# EAGLE design v03b (1) (EAGLE 6.1)
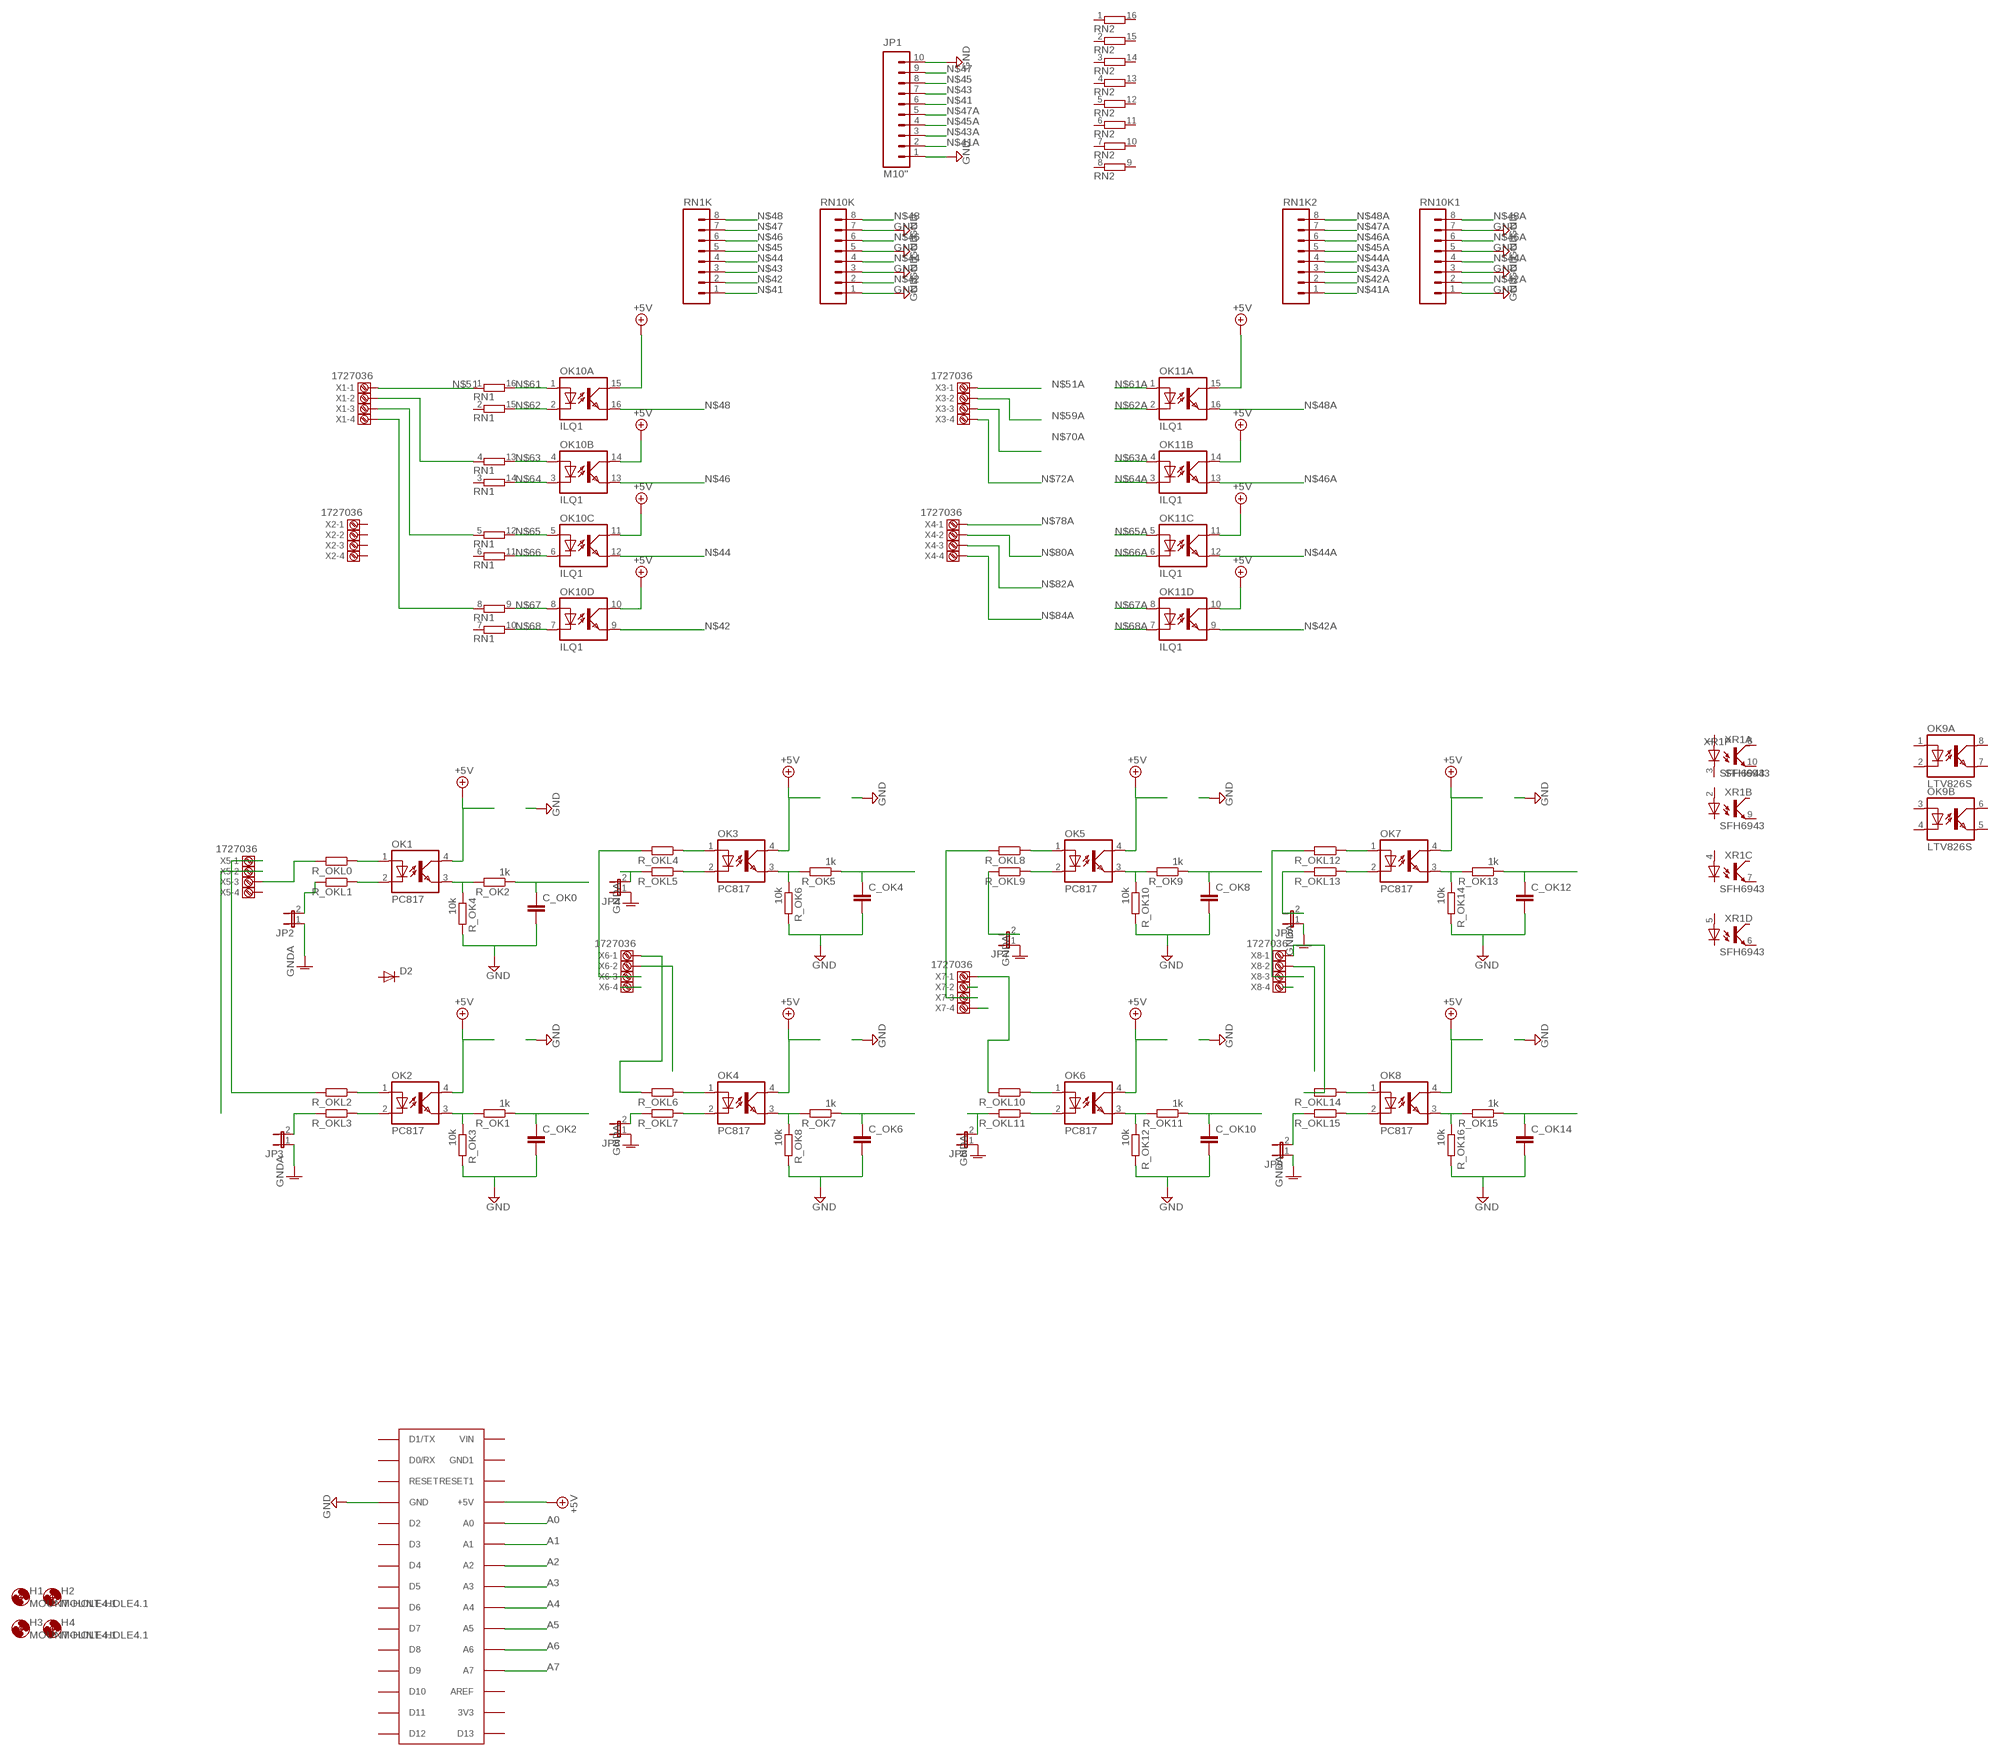
[diagram p0: schematic, sheet 1]

## Parts
C_OK0  C-EUC0805  [C0805]
C_OK2  C-EUC0805  [C0805]
C_OK4  C-EUC0805  [C0805]
C_OK6  C-EUC0805  [C0805]
C_OK8  C-EUC0805  [C0805]
C_OK10  C-EUC0805  [C0805]
C_OK12  C-EUC0805  [C0805]
C_OK14  C-EUC0805  [C0805]
D2  DIODESOD  [SOD-323]
H1  MOUNT-HOLE4.1  [4,1]
H2  MOUNT-HOLE4.1  [4,1]
H3  MOUNT-HOLE4.1  [4,1]
H4  MOUNT-HOLE4.1  [4,1]
JP1  M10"  [1X10]
JP2  JUMPER-2PTH  [1X02]
JP3  JUMPER-2PTH  [1X02]
JP4  JUMPER-2PTH  [1X02]
JP5  JUMPER-2PTH  [1X02]
JP6  JUMPER-2PTH  [1X02]
JP7  JUMPER-2PTH  [1X02]
JP8  JUMPER-2PTH  [1X02]
JP9  JUMPER-2PTH  [1X02]
OK1  PC817  [DIL04]
OK2  PC817  [DIL04]
OK3  PC817  [DIL04]
OK4  PC817  [DIL04]
OK5  PC817  [DIL04]
OK6  PC817  [DIL04]
OK7  PC817  [DIL04]
OK8  PC817  [DIL04]
OK9  LTV826S  [DIL8-SMD]
OK10  ILQ1  [DIL16]
OK11  ILQ1  [DIL16]
R_OK1  1k  R-EU_M0805  [M0805]
R_OK2  1k  R-EU_M0805  [M0805]
R_OK3  10k  R-EU_M0805  [M0805]
R_OK4  10k  R-EU_M0805  [M0805]
R_OK5  1k  R-EU_M0805  [M0805]
R_OK6  10k  R-EU_M0805  [M0805]
R_OK7  1k  R-EU_M0805  [M0805]
R_OK8  10k  R-EU_M0805  [M0805]
R_OK9  1k  R-EU_M0805  [M0805]
R_OK10  10k  R-EU_M0805  [M0805]
R_OK11  1k  R-EU_M0805  [M0805]
R_OK12  10k  R-EU_M0805  [M0805]
R_OK13  1k  R-EU_M0805  [M0805]
R_OK14  10k  R-EU_M0805  [M0805]
R_OK15  1k  R-EU_M0805  [M0805]
R_OK16  10k  R-EU_M0805  [M0805]
R_OKL0  R-EU_R1210  [R1210]
R_OKL1  R-EU_R1210  [R1210]
R_OKL2  R-EU_R1210  [R1210]
R_OKL3  R-EU_R1210  [R1210]
R_OKL4  R-EU_R1210  [R1210]
R_OKL5  R-EU_R1210  [R1210]
R_OKL6  R-EU_R1210  [R1210]
R_OKL7  R-EU_R1210  [R1210]
R_OKL8  R-EU_R1210  [R1210]
R_OKL9  R-EU_R1210  [R1210]
R_OKL10  R-EU_R1210  [R1210]
R_OKL11  R-EU_R1210  [R1210]
R_OKL12  R-EU_R1210  [R1210]
R_OKL13  R-EU_R1210  [R1210]
R_OKL14  R-EU_R1210  [R1210]
R_OKL15  R-EU_R1210  [R1210]
RN1  8R-PSOMC  [SOMC16]
RN1K  M081X08  [1X08]
RN1K2  M081X08  [1X08]
RN2  8R-PSOMC  [SOMC16]
RN10K  M081X08  [1X08]
RN10K1  M081X08  [1X08]
U$1  ARDUINONANO  [PDIP-32]
X1  1727036  [1727036]
X2  1727036  [1727036]
X3  1727036  [1727036]
X4  1727036  [1727036]
X5  1727036  [1727036]
X6  1727036  [1727036]
X7  1727036  [1727036]
X8  1727036  [1727036]
XR1  SFH6943  [SOT223/10]

## Nets
+5V: OK1.4(COL) OK2.4(COL) OK3.4(COL) OK4.4(COL) OK5.4(COL) OK6.4(COL) OK7.4(COL) OK8.4(COL) OK10.10(D:COL) OK10.11(C:COL) OK10.14(B:COL) OK10.15(A:COL) OK11.10(D:COL) OK11.11(C:COL) OK11.14(B:COL) OK11.15(A:COL) U$1.+5V
A0: C_OK0.1 R_OK2.1 U$1.A0
A1: C_OK2.1 R_OK1.1 U$1.A1
A2: C_OK4.1 R_OK5.1 U$1.A2
A3: C_OK6.1 R_OK7.1 U$1.A3
A4: C_OK8.1 R_OK9.1 U$1.A4
A5: C_OK10.1 R_OK11.1 U$1.A5
A6: C_OK12.1 R_OK13.1 U$1.A6
A7: C_OK14.1 R_OK15.1 U$1.A7
GND: C_OK0.2 C_OK2.2 C_OK4.2 C_OK6.2 C_OK8.2 C_OK10.2 C_OK12.2 C_OK14.2 JP1.1 JP1.10 R_OK3.2 R_OK4.2 R_OK6.2 R_OK8.2 R_OK10.2 R_OK12.2 R_OK14.2 R_OK16.2 RN10K1.1 RN10K1.3 RN10K1.5 RN10K1.7 RN10K.1 RN10K.3 RN10K.5 RN10K.7 U$1.GND
GNDA: JP2.1 JP3.1 JP4.1 JP5.1 JP6.1 JP7.1 JP8.1 JP9.1
N$1: JP3.2 R_OKL3.2
N$2: JP5.2 R_OKL7.2
N$3: X6.4
N$4: X7.4
N$5: X7.2
N$6: JP9.2 R_OKL15.2
N$7: X8.4
N$9: OK1.1(A) R_OKL0.1
N$10: JP2.2 R_OKL1.2
N$11: OK1.2(C) R_OKL1.1
N$12: OK2.1(A) R_OKL2.1
N$13: OK1.3(EMIT) R_OK2.2 R_OK4.1
N$14: R_OKL14.2 X8.1
N$15: OK2.3(EMIT) R_OK1.2 R_OK3.1
N$16: OK7.1(A) R_OKL12.1
N$17: X5.2
N$18: OK2.2(C) R_OKL3.1
N$19: OK3.1(A) R_OKL4.1
N$20: R_OKL2.2 X5.1
N$21: OK3.3(EMIT) R_OK5.2 R_OK6.1
N$22: OK7.3(EMIT) R_OK13.2 R_OK14.1
N$23: OK3.2(C) R_OKL5.1
N$24: OK4.1(A) R_OKL6.1
N$25: JP8.2 R_OKL13.2
N$26: OK4.3(EMIT) R_OK7.2 R_OK8.1
N$27: OK7.2(C) R_OKL13.1
N$28: OK4.2(C) R_OKL7.1
N$29: OK5.1(A) R_OKL8.1
N$30: JP4.2 R_OKL5.2
N$31: OK5.3(EMIT) R_OK9.2 R_OK10.1
N$32: OK8.1(A) R_OKL14.1
N$33: OK5.2(C) R_OKL9.1
N$34: OK6.1(A) R_OKL10.1
N$35: R_OKL6.2 X6.1
N$36: OK6.3(EMIT) R_OK11.2 R_OK12.1
N$37: X6.2
N$38: OK6.2(C) R_OKL11.1
N$39: OK8.3(EMIT) R_OK15.2 R_OK16.1
N$40: OK8.2(C) R_OKL15.1
N$41: JP1.6 RN1K.1
N$41A: JP1.2 RN1K2.1
N$42: OK10.9(D:EMIT) RN1K.2 RN10K.2
N$42A: OK11.9(D:EMIT) RN1K2.2 RN10K1.2
N$43: JP1.7 RN1K.3
N$43A: JP1.3 RN1K2.3
N$44: OK10.12(C:EMIT) RN1K.4 RN10K.4
N$44A: OK11.12(C:EMIT) RN1K2.4 RN10K1.4
N$45: JP1.8 RN1K.5
N$45A: JP1.4 RN1K2.5
N$46: OK10.13(B:EMIT) RN1K.6 RN10K.6
N$46A: OK11.13(B:EMIT) RN1K2.6 RN10K1.6
N$47: JP1.9 RN1K.7
N$47A: JP1.5 RN1K2.7
N$48: OK10.16(A:EMIT) RN1K.8 RN10K.8
N$48A: OK11.16(A:EMIT) RN1K2.8 RN10K1.8
N$49: R_OKL8.2 X7.3
N$50: JP7.2 R_OKL9.2
N$51: RN1.1 X1.1
N$51A: X3.1
N$52: JP6.2 R_OKL11.2
N$53: RN1.4 X1.2
N$54: RN1.5 X1.3
N$55: X8.2
N$56: R_OKL10.2 X7.1
N$57: R_OKL12.2 X8.3
N$58: R_OKL4.2 X6.3
N$59: RN1.8 X1.4
N$59A: X3.2
N$60: R_OKL0.2 X5.3
N$61: OK10.1(A:A) RN1.16
N$61A: OK11.1(A:A)
N$62: OK10.2(A:C) RN1.15
N$62A: OK11.2(A:C)
N$63: OK10.4(B:A) RN1.13
N$63A: OK11.4(B:A)
N$64: OK10.3(B:C) RN1.14
N$64A: OK11.3(B:C)
N$65: OK10.5(C:A) RN1.12
N$65A: OK11.5(C:A)
N$66: OK10.6(C:C) RN1.11
N$66A: OK11.6(C:C)
N$67: OK10.8(D:A) RN1.9
N$67A: OK11.8(D:A)
N$68: OK10.7(D:C) RN1.10
N$68A: OK11.7(D:C)
N$70A: X3.3
N$72A: X3.4
N$78A: X4.1
N$80A: X4.2
N$82A: X4.3
N$84A: X4.4
Unconnected: D2.1(C) D2.2(A) OK9.1(A:A) OK9.2(A:C) OK9.3(B:A) OK9.4(B:C) OK9.5(B:EMIT) OK9.6(B:COL) OK9.7(A:EMIT) OK9.8(A:COL) RN1.2 RN1.3 RN1.6 RN1.7 RN2.1 RN2.2 RN2.3 RN2.4 RN2.5 RN2.6 RN2.7 RN2.8 RN2.9 RN2.10 RN2.11 RN2.12 RN2.13 RN2.14 RN2.15 RN2.16 U$1.3V3 U$1.AREF U$1.D0/RX U$1.D1/TX U$1.D2 U$1.D3 U$1.D4 U$1.D5 U$1.D6 U$1.D7 U$1.D8 U$1.D9 U$1.D10 U$1.D11 U$1.D12 U$1.D13 U$1.GND1 U$1.RESET U$1.RESET1 U$1.VIN X2.1 X2.2 X2.3 X2.4 X5.4 XR1.1(A:A) XR1.2(B:A) XR1.3(P:COM-CAT) XR1.4(C:A) XR1.5(D:A) XR1.6(D:EMI) XR1.7(C:EMI) XR1.8(P:COM-COL) XR1.9(B:EMI) XR1.10(A:EMI)

## Library data of the parts
C_OK0 C_OK2 C_OK4 C_OK6 C_OK8 C_OK10 C_OK12 C_OK14 = rcl:C-EU: CAPACITOR, European symbol
D2 = SparkFun-DiscreteSemi:DIODE: Diode These are standard reverse protection diodes and small signal diodes. SMA package can handle up to about 1A. SOD-323 can handle about 200mA. What the SOD-323 package when ordering, there are some mfgs out there that are 5-pin packages.
H1-H4 = holes:MOUNT-HOLE: MOUNTING HOLE with drill center marker
JP1 = SparkFun-Connectors:M10: Header 10 Standard 10-pin 0.1" header. Use with straight break away headers (SKU : PRT-00116), right angle break away headers (PRT-00553), swiss pins (PRT-00743), machine pins (PRT-00117), and female headers (PRT-00115).
JP2-JP9 = SparkFun-Passives:JUMPER-2: Jumper Basic 0.1" spaced jumper. Use with breakaway headers.
OK1-OK8 = optocoupler:PC817: SHARP OPTO COUPLER; MPN: PC817X4J000F; OC_FARNELL: 9707727; OC_NEWARK: 97K7059
OK9 = optocoupler:LTV826: OPTO COUPLER Source: LITEON, LTV816.pdf; OC_FARNELL: unknown; OC_NEWARK: unknown
OK10 OK11 = optocoupler:ILQ1: SIEMENS OPTO COUPLER; MF: VISHAY/TELEFUNKEN; MPN: ILQ1; OC_FARNELL: 1469501; OC_NEWARK: 88K1954
R_OK1-R_OK16 R_OKL0 R_OKL1-R_OKL15 = rcl:R-EU_: RESISTOR, European symbol
RN1 RN2 = resistor-dil:8R-P: DIL RESISTOR; OC_FARNELL: unknown; OC_NEWARK: unknown
RN1K RN1K2 RN10K RN10K1 = SparkFun-Connectors:M08: Header 8 Standard 8-pin 0.1" header. Use with straight break away headers (SKU : PRT-00116), right angle break away headers (PRT-00553), swiss pins (PRT-00743), machine pins (PRT-00117), and female headers (PRT-00115).
U$1 = jet-lib:ARDUINONANO
X1-X8 = con-phoenix-3.81:1727036: MKDS 1/4-3,81 Source: http://eshop.phoenixcontact.de; MF: FARNELL; MPN: 1727036; OC_FARNELL: 3704592; OC_NEWARK: 71C4114
XR1 = opto-vishay:SFH6943: Optocoupler, Phototransistor Output Quad Channel Source: http://www.vishay.com/docs/83688/83688.pdf; MPN: SFH6943A-4T; OC_FARNELL: 1045530; OC_NEWARK: 66M1324

## Board
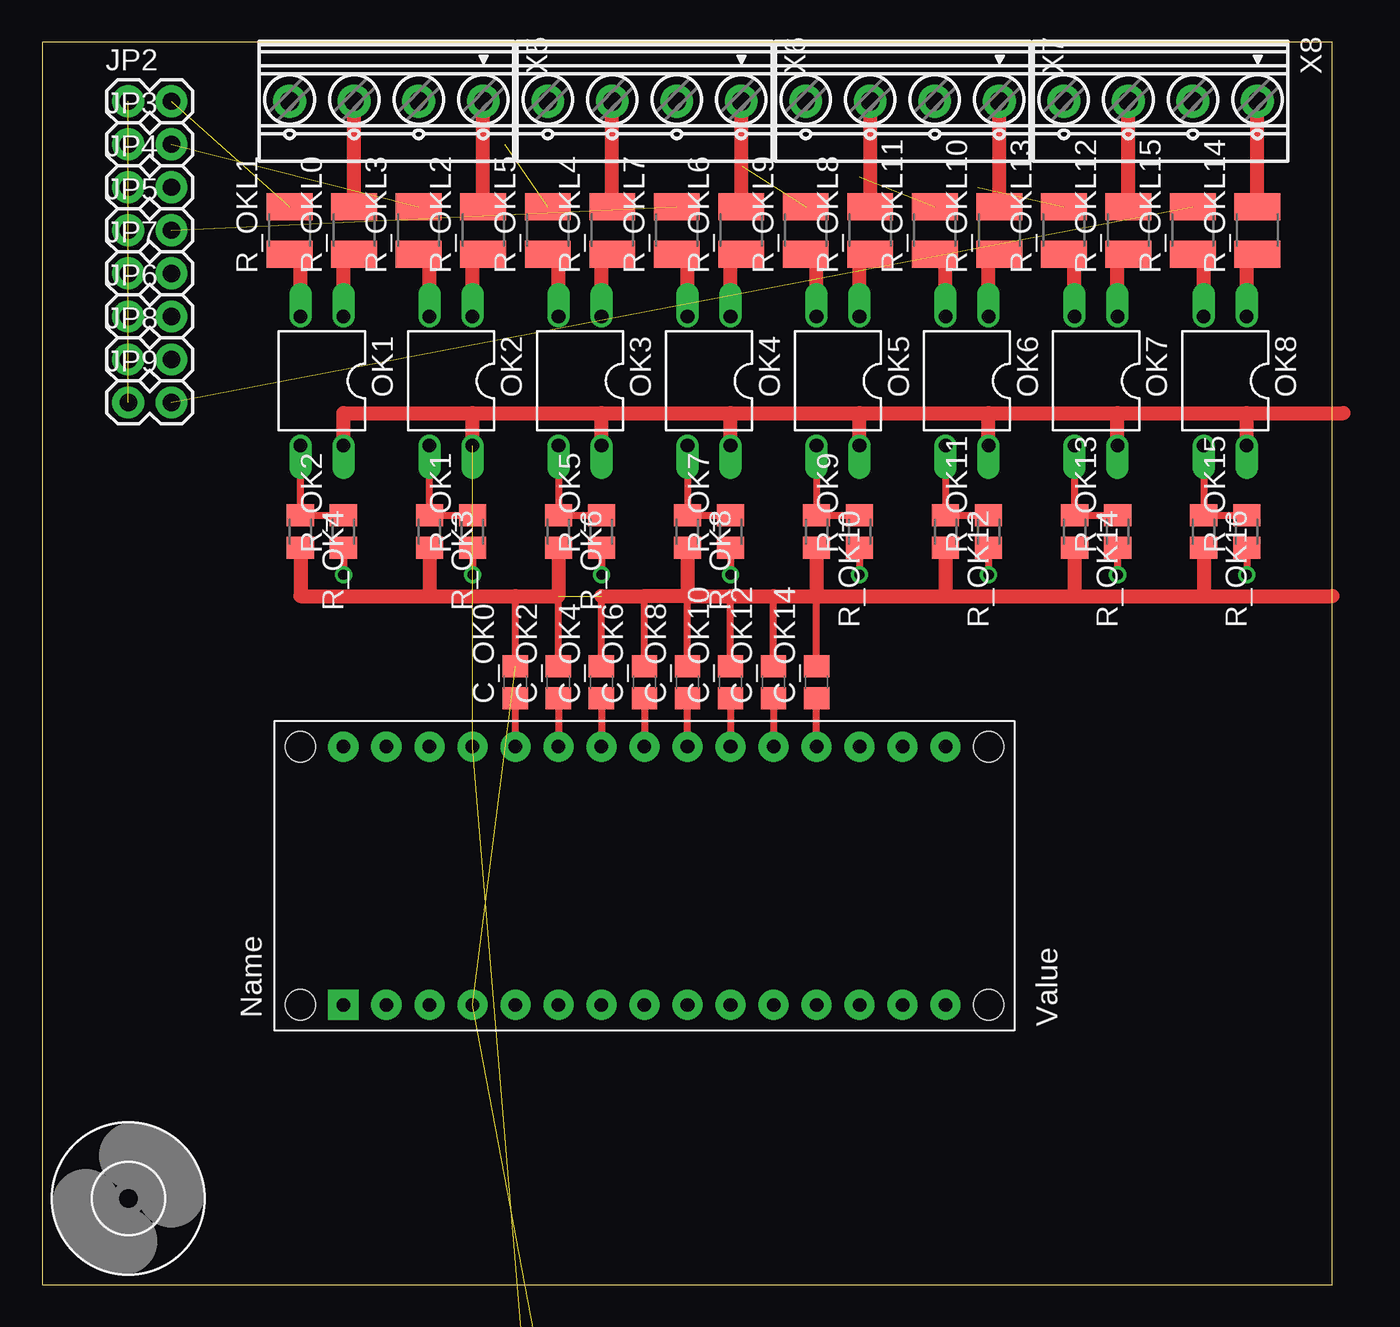
[diagram p1: board, top side]
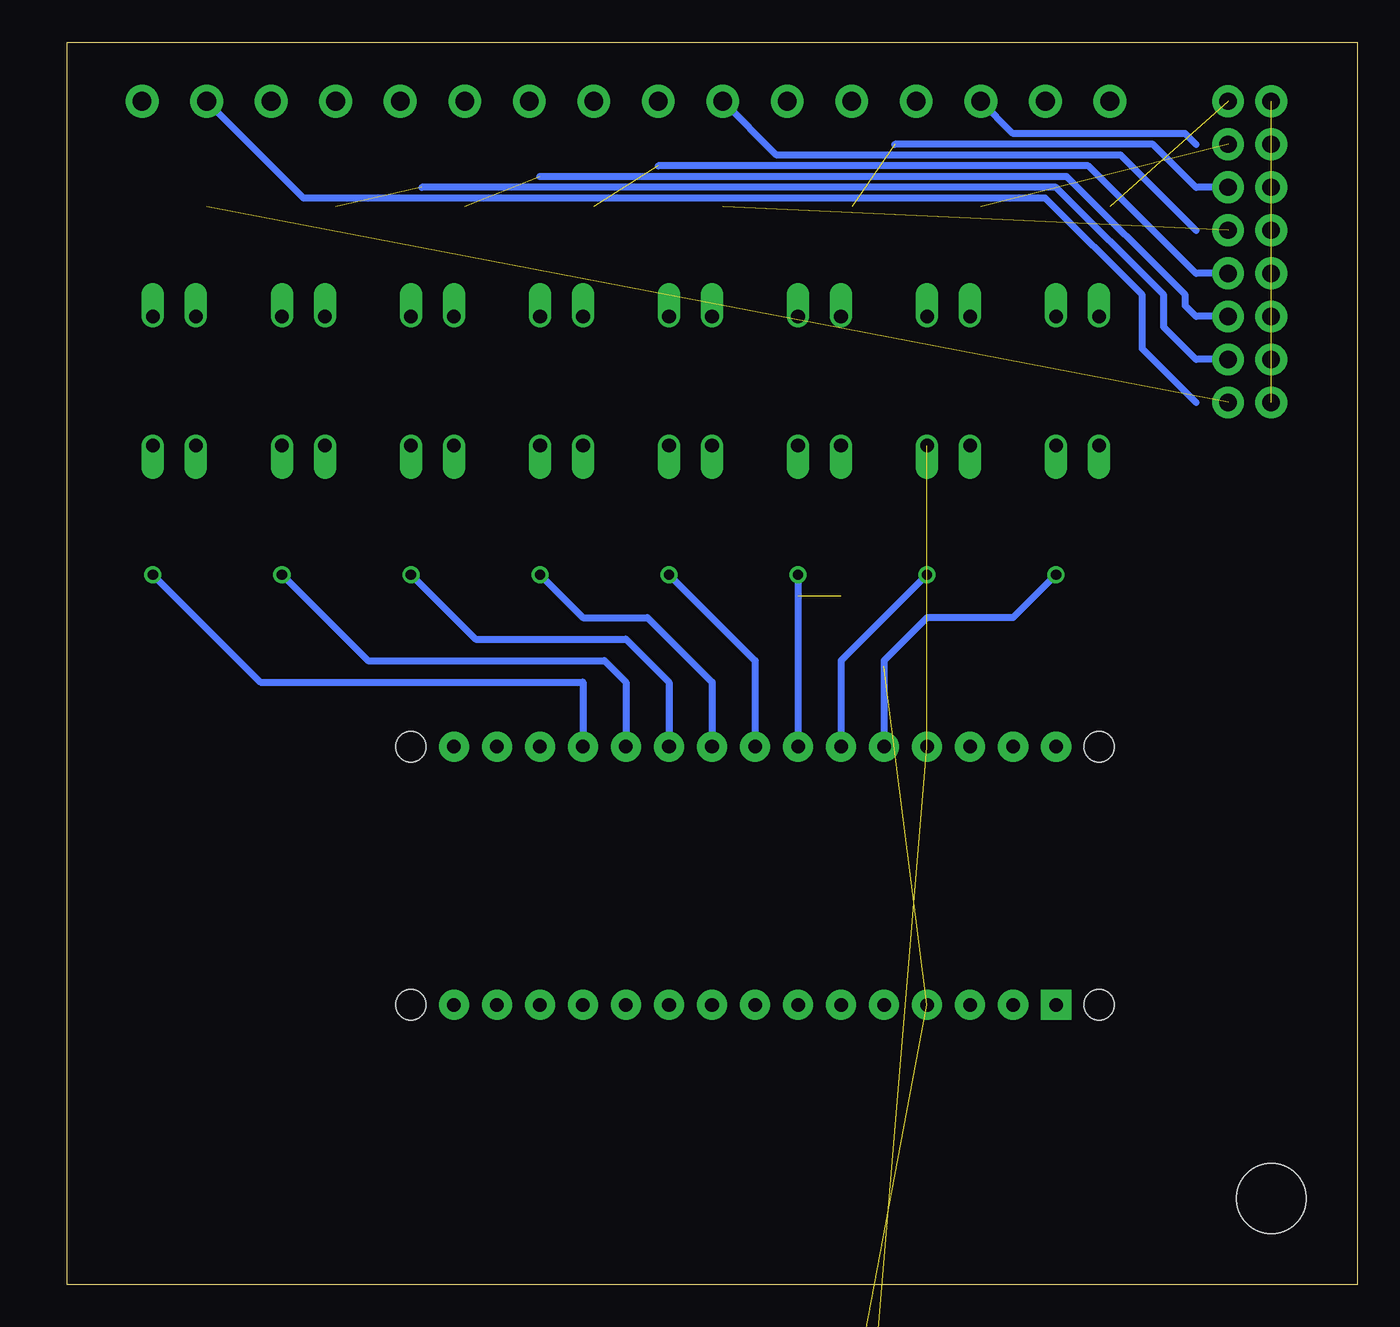
[diagram p2: board, bottom side, seen from below]

Size 76.18 x 73.33 mm. Coordinates in mm from the lower left corner, seen from the top.
Outline: 0,0 76.18,0 76.18,73.33 0,73.33 0,0
Copper layers (1*16): Top 0.035mm / dielectric 1.5mm / Bottom 0.035mm
Design rules: minimum track width 10mil, minimum drill 24mil, track to track 8mil, track to pad 8mil, pad to pad 8mil, via to via 8mil, smd to smd 8mil, copper to edge 40mil, drill to drill 8mil, minimum pad ring 10mil, minimum via ring 8mil, stop-mask expansion 4mil, vias tented up to drill 0mil, thermal gap 10mil

### Footprints (pad centres in the part's own frame; a part is rotated, then mirrored left to right if it is on the bottom)
C0805 = smd 1.3 x 1.5: 1 -0.95,0; 2 0.95,0
SOD-323 = smd 0.63 x 0.83: 1 -1.15,0; 2 1.15,0
4,1 = hole 4.1: 0,0
1X10 = drill 1.016 pad 1.88: 1 0,0; 2 2.54,0; 3 5.08,0; 4 7.62,0; 5 10.16,0; 6 12.7,0; 7 15.24,0; 8 17.78,0; 9 20.32,0; 10 22.86,0
1X02 = drill 1.016 pad 1.88: 1 0,0; 2 2.54,0
DIL04 = drill 0.813 offset: 1 -1.27,-3.81; 2 1.27,-3.81; 3 1.27,3.81; 4 -1.27,3.81
DIL8-SMD = smd 1.6 x 2: 1 -3.81,-4.77; 2 -1.27,-4.77; 3 1.27,-4.77; 4 3.81,-4.77; 5 3.81,4.77; 6 1.27,4.77; 7 -1.27,4.77; 8 -3.81,4.77
DIL16 = drill 0.813 offset: 1 -8.89,-3.81; 2 -6.35,-3.81; 3 -3.81,-3.81; 4 -1.27,-3.81; 5 1.27,-3.81; 6 3.81,-3.81; 7 6.35,-3.81; 8 8.89,-3.81; 9 8.89,3.81; 10 6.35,3.81; 11 3.81,3.81; 12 1.27,3.81; 13 -1.27,3.81; 14 -3.81,3.81; 15 -6.35,3.81; 16 -8.89,3.81
M0805 = smd 1.3 x 1.6: 1 -0.95,0; 2 0.95,0
R1210 = smd 1.6 x 2.7: 1 -1.4,0; 2 1.4,0
SOMC16 = smd 1.91 x 0.64: 1 -3.62,4.445; 2 -3.62,3.175; 3 -3.62,1.905; 4 -3.62,0.635; 5 -3.62,-0.635; 6 -3.62,-1.905; 7 -3.62,-3.175; 8 -3.62,-4.445; 9 3.62,-4.445; 10 3.62,-3.175; 11 3.62,-1.905; 12 3.62,-0.635; 13 3.62,0.635; 14 3.62,1.905; 15 3.62,3.175; 16 3.62,4.445
1X08 = drill 1.016 pad 1.88 square: 1 0,0 | drill 1.016 pad 1.88: 2 2.54,0; 3 5.08,0; 4 7.62,0; 5 10.16,0; 6 12.7,0; 7 15.24,0; 8 17.78,0
PDIP-32 = drill 0.8 pad 1.778: 3V3 15.24,-35.56; +5V 15.24,-10.16; A0 15.24,-12.7; A1 15.24,-15.24; A2 15.24,-17.78; A3 15.24,-20.32; A4 15.24,-22.86; A5 15.24,-25.4; A6 15.24,-27.94; A7 15.24,-30.48; AREF 15.24,-33.02; D0/RX 0,-5.08; D2 0,-12.7; D3 0,-15.24; D4 0,-17.78; D5 0,-20.32; D6 0,-22.86; D7 0,-25.4; D8 0,-27.94; D9 0,-30.48; D10 0,-33.02; D11 0,-35.56; D12 0,-38.1; D13 15.24,-38.1; GND 0,-10.16; GND1 15.24,-5.08; RESET 0,-7.62; RESET1 15.24,-7.62; VIN 15.24,-2.54 | drill 0.8 pad 1.778 square: D1/TX 0,-2.54 | hole 1.778: 0,0; 0,-40.64; 15.24,-40.64; 15.24,0
1727036 = drill 1.1 pad 1.93: 1 -5.715,0; 2 -1.905,0; 3 1.905,0; 4 5.715,0
SOT223/10 = smd 0.66 x 1.02: 1 -2.54,-3.251; 2 -1.27,-3.251; 3 0,-3.251; 4 1.27,-3.251; 5 2.54,-3.251; 6 2.54,3.251; 7 1.27,3.251; 9 -1.27,3.251; 10 -2.54,3.251 | smd 1.35 x 1.02: 8 0,3.251

### Placement (x,y rotation side)
C_OK0  27.94,35.56 90 top
C_OK2  30.48,35.56 90 top
C_OK4  33.02,35.56 90 top
C_OK6  35.56,35.56 90 top
C_OK8  38.1,35.56 90 top
C_OK10  40.64,35.56 90 top
C_OK12  43.18,35.56 90 top
C_OK14  45.72,35.56 90 top
D2  -7.62,66.04 0 top  (outside the outline)
H1  -13.97,73.66 0 top  (outside the outline)
H2  114.3,68.58 0 top  (outside the outline)
H3  5.08,5.08 0 top
H4  114.3,5.08 0 top  (outside the outline)
JP1  22.86,-12.7 180 top  (outside the outline)
JP2  5.08,69.85 0 top
JP3  5.08,67.31 0 top
JP4  5.08,64.77 0 top
JP5  5.08,62.23 0 top
JP6  5.08,57.15 0 top
JP7  5.08,59.69 0 top
JP8  5.08,54.61 0 top
JP9  5.08,52.07 0 top
OK1  16.51,53.34 180 top
OK2  24.13,53.34 180 top
OK3  31.75,53.34 180 top
OK4  39.37,53.34 180 top
OK5  46.99,53.34 180 top
OK6  54.61,53.34 180 top
OK7  62.23,53.34 180 top
OK8  69.85,53.34 180 top
OK9  15.24,106.68 0 top  (outside the outline)
OK10  -1.27,-33.02 0 top  (outside the outline)
OK11  24.13,-33.02 0 top  (outside the outline)
R_OK1  25.4,44.45 90 top
R_OK2  17.78,44.45 90 top
R_OK3  22.86,44.45 270 top
R_OK4  15.24,44.45 270 top
R_OK5  33.02,44.45 90 top
R_OK6  30.48,44.45 270 top
R_OK7  40.64,44.45 90 top
R_OK8  38.1,44.45 270 top
R_OK9  48.26,44.45 90 top
R_OK10  45.72,44.45 270 top
R_OK11  55.88,44.45 90 top
R_OK12  53.34,44.45 270 top
R_OK13  63.5,44.45 90 top
R_OK14  60.96,44.45 270 top
R_OK15  71.12,44.45 90 top
R_OK16  68.58,44.45 270 top
R_OKL0  18.41,62.23 90 top
R_OKL1  14.61,62.23 90 top
R_OKL2  26.04,62.23 90 top
R_OKL3  22.23,62.23 90 top
R_OKL4  33.66,62.23 90 top
R_OKL5  29.84,62.23 90 top
R_OKL6  41.27,62.23 90 top
R_OKL7  37.47,62.23 90 top
R_OKL8  48.9,62.23 90 top
R_OKL9  45.09,62.23 90 top
R_OKL10  56.52,62.23 90 top
R_OKL11  52.7,62.23 90 top
R_OKL12  64.14,62.23 90 top
R_OKL13  60.33,62.23 90 top
R_OKL14  71.75,62.23 90 top
R_OKL15  67.94,62.23 90 top
RN1  -1.27,-45.72 90 top  (outside the outline)
RN1K  7.62,-19.05 180 top  (outside the outline)
RN1K2  33.02,-19.05 180 top  (outside the outline)
RN2  24.13,-45.72 90 top  (outside the outline)
RN10K  7.62,-24.13 180 top  (outside the outline)
RN10K1  33.02,-24.13 180 top  (outside the outline)
U$1  15.24,16.51 90 top
X1  -1.27,-55.88 0 top  (outside the outline)
X2  25.4,-55.88 0 top  (outside the outline)
X3  60.96,-54.61 0 top  (outside the outline)
X4  90.17,-52.07 0 top  (outside the outline)
X5  20.32,69.85 180 top
X6  35.56,69.85 180 top
X7  50.8,69.85 180 top
X8  66.04,69.85 180 top
XR1  -10.16,87.63 0 top  (outside the outline)

### Tracks (layer width: path | path; a pad name or v marks a point on that pad's centre or on a via)
+5V  (9 unrouted)
  Top 0.813: OK1.4 17.78,51.44 25.4,51.44 | 25.4,51.44 33.02,51.44 | 33.02,51.44 40.64,51.44 | 40.64,51.44 48.26,51.44 | 48.26,51.44 55.88,51.44 | 55.88,51.44 63.5,51.44 | 63.5,51.44 71.12,51.44 | 71.12,51.44 76.83,51.44 | OK2.4 25.4,51.44 | OK3.4 33.02,51.44 | OK4.4 40.64,51.44 | OK5.4 48.26,51.44 | OK6.4 55.88,51.44 | OK7.4 63.5,51.44 | OK8.4 71.12,51.44
A0  (via drill 0.6)
  Top 0.406: R_OK2.1 v17.78,41.91 | U$1.A0 C_OK0.1
  Bottom 0.406: v17.78,41.91 20.32,39.37 25.4,39.37 27.94,36.83 U$1.A0
A1  (via drill 0.6)
  Top 0.406: R_OK1.1 v25.4,41.91 | C_OK2.1 U$1.A1
  Bottom 0.406: v25.4,41.91 30.48,36.83 U$1.A1
A2  (via drill 0.6)
  Top 0.406: R_OK5.1 v33.02,41.91 | C_OK4.1 U$1.A2
  Bottom 0.406: v33.02,41.91 U$1.A2
A3  (via drill 0.6)
  Top 0.406: R_OK7.1 v40.64,41.91 | C_OK6.1 U$1.A3
  Bottom 0.406: v40.64,41.91 35.56,36.83 U$1.A3
A4  (via drill 0.6)
  Top 0.406: R_OK9.1 v48.26,41.91 | U$1.A4 C_OK8.1
  Bottom 0.406: v48.26,41.91 45.72,39.37 41.91,39.37 38.1,35.56 U$1.A4
A5  (via drill 0.6)
  Top 0.406: R_OK11.1 v55.88,41.91 | C_OK10.1 U$1.A5
  Bottom 0.406: v55.88,41.91 52.07,38.1 43.18,38.1 40.64,35.56 U$1.A5
A6  (via drill 0.6)
  Top 0.406: R_OK13.1 v63.5,41.91 | C_OK12.1 U$1.A6
  Bottom 0.406: v63.5,41.91 58.42,36.83 44.45,36.83 43.18,35.56 U$1.A6
A7  (via drill 0.6)
  Top 0.406: R_OK15.1 v71.12,41.91 | U$1.A7 C_OK14.1
  Bottom 0.406: v71.12,41.91 64.77,35.56 45.72,35.56 U$1.A7
GND  (12 unrouted)
  Top 0.406: C_OK0.2 27.94,40.64 | C_OK2.2 30.48,40.64 | C_OK4.2 33.02,40.64 | C_OK8.2 38.1,40.64 | C_OK6.2 35.56,40.64 | C_OK10.2 40.64,40.64 | C_OK12.2 43.18,40.64 | C_OK14.2 45.72,40.64
  Top 0.813: R_OK4.2 15.24,40.64 22.86,40.64 | 22.86,40.64 27.94,40.64 30.48,40.64 R_OK6.2 | 33.02,40.64 35.56,40.64 38.1,40.64 | 45.72,40.64 43.18,40.64 40.64,40.64 38.1,40.64 | 45.72,40.64 53.34,40.64 | 53.34,40.64 60.96,40.64 | 60.96,40.64 68.58,40.64 | 68.58,40.64 76.2,40.64 | R_OK3.2 22.86,40.64 | R_OK8.2 38.1,40.64 | R_OK10.2 45.72,40.64 | R_OK12.2 53.34,40.64 | R_OK14.2 60.96,40.64 | R_OK16.2 68.58,40.64
GNDA  (7 unrouted)
N$1  (1 unrouted)
N$2  (1 unrouted)
N$6  (1 unrouted)
N$9
  Top 0.813: OK1.1 17.78,60.2 R_OKL0.1
N$10  (1 unrouted)
N$11
  Top 0.813: OK1.2 15.24,60.2 R_OKL1.1
N$12
  Top 0.813: OK2.1 25.4,60.2 R_OKL2.1
N$13
  Top 0.406: OK1.3 R_OK4.1 R_OK2.2
N$14
  Top 0.813: R_OKL14.2 X8.1
N$15
  Top 0.406: OK2.3 R_OK3.1 R_OK1.2
N$16
  Top 0.813: OK7.1 63.5,60.2 R_OKL12.1
N$17
  Bottom 0.406: 9.53,67.31 10.16,67.94 20.32,67.94 X5.2
N$18
  Top 0.813: OK2.2 22.86,60.2 R_OKL3.1
N$19
  Top 0.813: OK3.1 33.02,60.2 R_OKL4.1
N$20
  Top 0.813: R_OKL2.2 X5.1
N$21
  Top 0.406: OK3.3 R_OK6.1 R_OK5.2
N$22
  Top 0.406: OK7.3 R_OK14.1 R_OK13.2
N$23
  Top 0.813: OK3.2 30.48,60.2 R_OKL5.1
N$24
  Top 0.813: OK4.1 40.64,60.2 R_OKL6.1
N$25  (1 unrouted)
  Bottom 0.406: JP8.2 9.53,54.61 11.43,56.52 11.43,58.42 17.78,64.77 55.24,64.77
N$26
  Top 0.406: OK4.3 R_OK8.1 R_OK7.2
N$27
  Top 0.813: OK7.2 60.96,60.2 R_OKL13.1
N$28
  Top 0.813: OK4.2 38.1,60.2 R_OKL7.1
N$29
  Top 0.813: OK5.1 48.26,60.2 R_OKL8.1
N$30  (1 unrouted)
  Bottom 0.406: JP4.2 9.53,64.77 12.06,67.31 27.3,67.31
N$31
  Top 0.406: OK5.3 R_OK10.1 R_OK9.2
N$32
  Top 0.813: OK8.1 71.12,60.2 R_OKL14.1
N$33
  Top 0.813: OK5.2 45.72,60.2 R_OKL9.1
N$34
  Top 0.813: OK6.1 55.88,60.2 R_OKL10.1
N$35
  Top 0.813: R_OKL6.2 X6.1
N$36
  Top 0.406: OK6.3 R_OK12.1 R_OK11.2
N$37
  Bottom 0.406: X6.2 34.29,66.67 13.97,66.67 9.53,62.23
N$38
  Top 0.813: OK6.2 53.34,60.2 R_OKL11.1
N$39
  Top 0.406: OK8.3 R_OK16.1 R_OK15.2
N$40
  Top 0.813: OK8.2 68.58,60.2 R_OKL15.1
N$41  (1 unrouted)
N$41A  (1 unrouted)
N$42  (2 unrouted)
N$42A  (2 unrouted)
N$43  (1 unrouted)
N$43A  (1 unrouted)
N$44  (2 unrouted)
N$44A  (2 unrouted)
N$45  (1 unrouted)
N$45A  (1 unrouted)
N$46  (2 unrouted)
N$46A  (2 unrouted)
N$47  (1 unrouted)
N$47A  (1 unrouted)
N$48  (2 unrouted)
N$48A  (2 unrouted)
N$49
  Top 0.813: R_OKL8.2 X7.3
N$50  (1 unrouted)
  Bottom 0.406: JP7.2 9.53,59.69 15.88,66.04 41.27,66.04
N$51  (1 unrouted)
N$52  (1 unrouted)
  Bottom 0.406: JP6.2 9.53,57.15 10.16,57.78 10.16,58.42 17.14,65.41 48.26,65.41
N$53  (1 unrouted)
N$54  (1 unrouted)
N$55
  Bottom 0.406: X8.2 62.23,64.14 18.41,64.14 12.7,58.42 12.7,55.24 9.53,52.07
N$56
  Top 0.813: R_OKL10.2 X7.1
N$57
  Top 0.813: R_OKL12.2 X8.3
N$58
  Top 0.813: R_OKL4.2 X6.3
N$59  (1 unrouted)
N$60
  Top 0.813: R_OKL0.2 X5.3
N$61  (1 unrouted)
N$62  (1 unrouted)
N$63  (1 unrouted)
N$64  (1 unrouted)
N$65  (1 unrouted)
N$66  (1 unrouted)
N$67  (1 unrouted)
N$68  (1 unrouted)